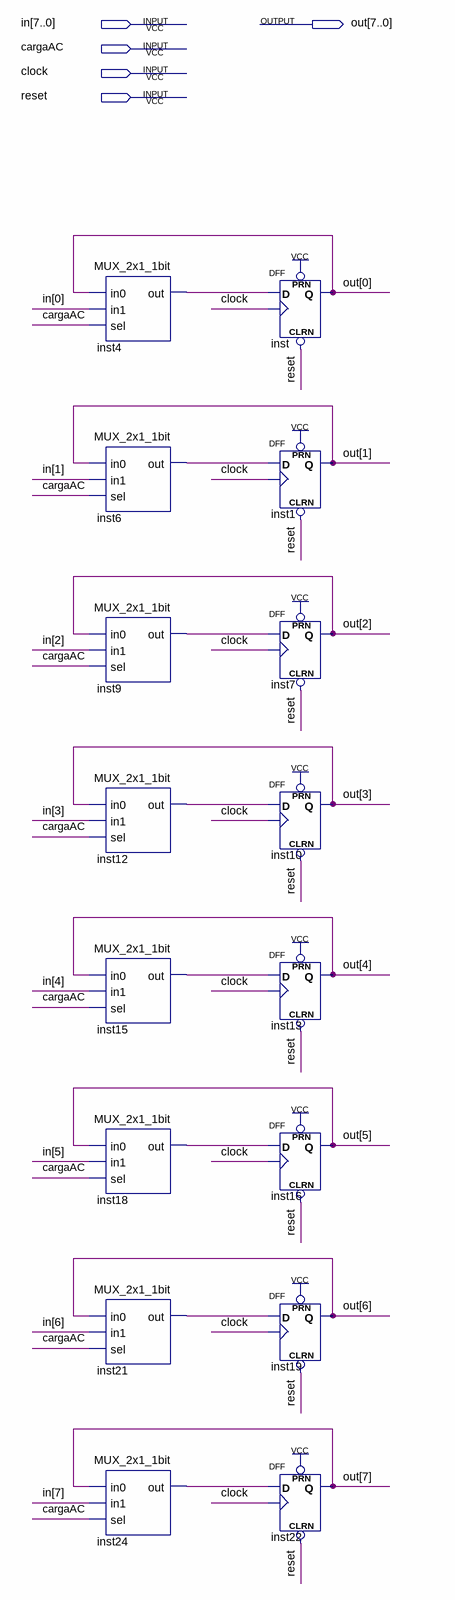
[diagram p0: schematic sheet]
// Quartus schematic Accumulator.bdf as structural Verilog: 16 symbols, 5 pins
module Accumulator (
  input  [7:0] in,
  input  cargaAC,
  input  clock,
  input  reset,
  output [7:0] out
);

  wire inst4_out, inst6_out, inst9_out, inst12_out, inst15_out, inst18_out, inst21_out, inst24_out;

  MUX_2x1_1bit inst4 (.in0(out[0]), .in1(in[0]), .sel(cargaAC), .out(inst4_out));
  MUX_2x1_1bit inst6 (.in0(out[1]), .in1(in[1]), .sel(cargaAC), .out(inst6_out));
  MUX_2x1_1bit inst9 (.in0(out[2]), .in1(in[2]), .sel(cargaAC), .out(inst9_out));
  MUX_2x1_1bit inst12 (.in0(out[3]), .in1(in[3]), .sel(cargaAC), .out(inst12_out));
  MUX_2x1_1bit inst15 (.in0(out[4]), .in1(in[4]), .sel(cargaAC), .out(inst15_out));
  MUX_2x1_1bit inst18 (.in0(out[5]), .in1(in[5]), .sel(cargaAC), .out(inst18_out));
  MUX_2x1_1bit inst21 (.in0(out[6]), .in1(in[6]), .sel(cargaAC), .out(inst21_out));
  MUX_2x1_1bit inst24 (.in0(out[7]), .in1(in[7]), .sel(cargaAC), .out(inst24_out));
  DFF inst (.CLRN(reset), .CLK(clock), .D(inst4_out), .PRN(1'b1), .Q(out[0]));
  DFF inst1 (.CLRN(reset), .CLK(clock), .D(inst6_out), .PRN(1'b1), .Q(out[1]));
  DFF inst7 (.CLRN(reset), .CLK(clock), .D(inst9_out), .PRN(1'b1), .Q(out[2]));
  DFF inst10 (.CLRN(reset), .CLK(clock), .D(inst12_out), .PRN(1'b1), .Q(out[3]));
  DFF inst13 (.CLRN(reset), .CLK(clock), .D(inst15_out), .PRN(1'b1), .Q(out[4]));
  DFF inst16 (.CLRN(reset), .CLK(clock), .D(inst18_out), .PRN(1'b1), .Q(out[5]));
  DFF inst19 (.CLRN(reset), .CLK(clock), .D(inst21_out), .PRN(1'b1), .Q(out[6]));
  DFF inst22 (.CLRN(reset), .CLK(clock), .D(inst24_out), .PRN(1'b1), .Q(out[7]));
endmodule
